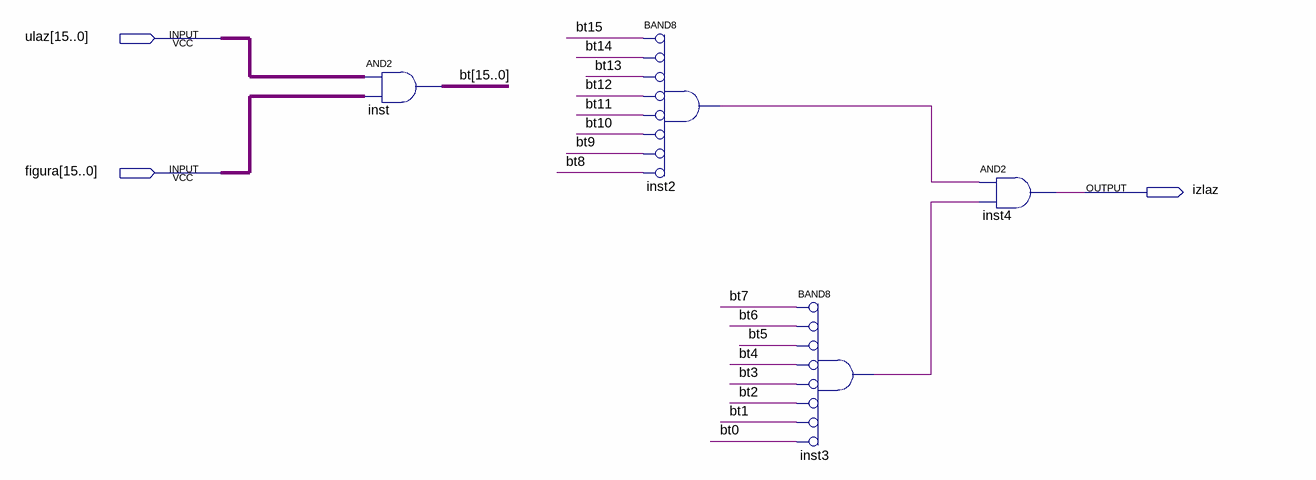
[diagram p0: schematic sheet]
// Quartus schematic provera.bdf as structural Verilog: 4 symbols, 3 pins
module provera (
  input  [15:0] ulaz,
  input  [15:0] figura,
  output izlaz
);

  wire inst2_out, inst3_out;
  wire [15:0] bt;

  assign bt = ulaz & figura;  // AND2 inst, 16 bits wide
  and inst2 (inst2_out, ~bt[15], ~bt[14], ~bt[13], ~bt[12], ~bt[11], ~bt[10], ~bt[9], ~bt[8]);  // BAND8
  and inst3 (inst3_out, ~bt[7], ~bt[6], ~bt[5], ~bt[4], ~bt[3], ~bt[2], ~bt[1], ~bt[0]);  // BAND8
  and inst4 (izlaz, inst2_out, inst3_out);
endmodule
